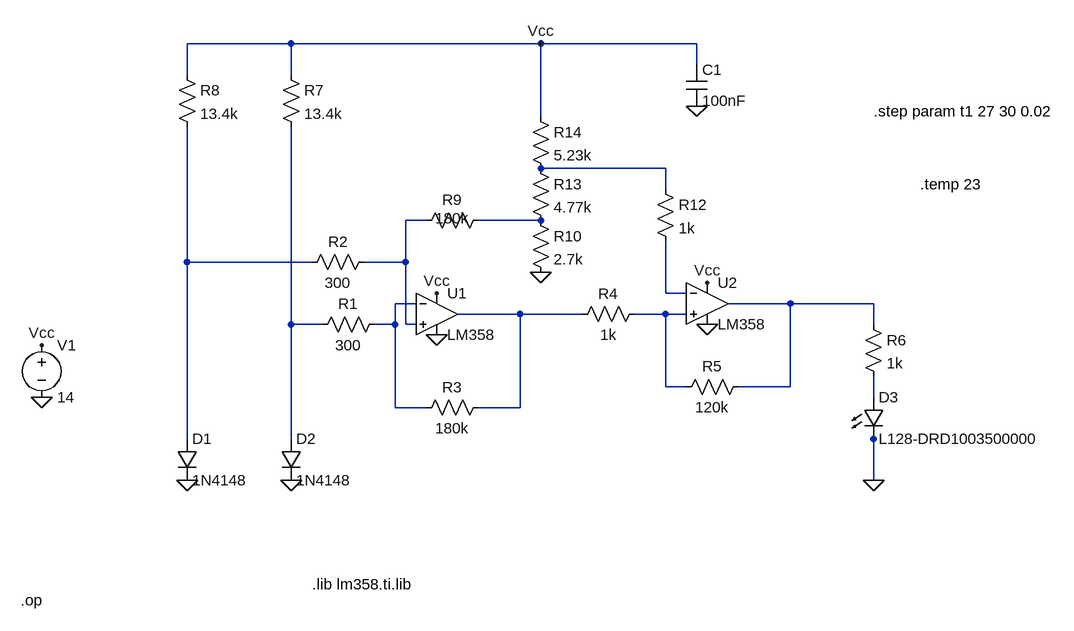
[diagram p0: schematic ECDLab1.asc]
ECDLab1.asc, the LTspice schematic file:
Version 4
SHEET 1 1204 808
WIRE -16 -176 -176 -176
WIRE 368 -176 -16 -176
WIRE 608 -176 368 -176
WIRE 608 -144 608 -176
WIRE -176 -128 -176 -176
WIRE -16 -128 -16 -176
WIRE 368 -64 368 -176
WIRE 560 16 368 16
WIRE 560 48 560 16
WIRE 192 96 160 96
WIRE 368 96 272 96
WIRE -176 160 -176 -48
WIRE 16 160 -176 160
WIRE 160 160 160 96
WIRE 160 160 96 160
WIRE 560 208 560 128
WIRE 592 208 560 208
WIRE 176 224 144 224
WIRE 752 224 656 224
WIRE 880 224 752 224
WIRE 336 240 240 240
WIRE 432 240 336 240
WIRE 560 240 512 240
WIRE 592 240 560 240
WIRE -16 256 -16 -48
WIRE 32 256 -16 256
WIRE 144 256 144 224
WIRE 144 256 112 256
WIRE 160 256 160 160
WIRE 176 256 160 256
WIRE 880 256 880 224
WIRE 560 352 560 240
WIRE 592 352 560 352
WIRE 752 352 752 224
WIRE 752 352 672 352
WIRE 880 368 880 336
WIRE 144 384 144 256
WIRE 192 384 144 384
WIRE 336 384 336 240
WIRE 336 384 272 384
WIRE -176 432 -176 160
WIRE -16 432 -16 256
WIRE 880 432 880 416
WIRE 880 496 880 432
FLAG -16 496 0
FLAG -176 496 0
FLAG 880 496 0
FLAG 608 -80 0
FLAG 208 208 Vcc
FLAG 368 -176 Vcc
FLAG 624 192 Vcc
FLAG -400 368 0
FLAG -400 288 Vcc
FLAG 208 272 0
FLAG 624 256 0
FLAG 368 176 0
SYMBOL res 128 240 R90
WINDOW 0 0 56 VBottom 2
WINDOW 3 32 56 VTop 2
SYMATTR InstName R1
SYMATTR Value 300
SYMBOL OpAmps\\opamp2 208 176 R0
SYMATTR InstName U1
SYMATTR Value LM358
SYMBOL res 112 144 R90
WINDOW 0 0 56 VBottom 2
WINDOW 3 32 56 VTop 2
SYMATTR InstName R2
SYMATTR Value 300
SYMBOL diode -192 432 R0
SYMATTR InstName D1
SYMATTR Value 1N4148
SYMBOL diode -32 432 R0
SYMATTR InstName D2
SYMATTR Value 1N4148
SYMATTR Value2 temp = { t1}
SYMBOL res 288 368 R90
WINDOW 0 0 56 VBottom 2
WINDOW 3 32 56 VTop 2
SYMATTR InstName R3
SYMATTR Value 180k
SYMBOL res 528 224 R90
WINDOW 0 0 56 VBottom 2
WINDOW 3 32 56 VTop 2
SYMATTR InstName R4
SYMATTR Value 1k
SYMBOL OpAmps\\opamp2 624 160 R0
SYMATTR InstName U2
SYMATTR Value LM358
SYMBOL res 688 336 R90
WINDOW 0 0 56 VBottom 2
WINDOW 3 32 56 VTop 2
SYMATTR InstName R5
SYMATTR Value 120k
SYMBOL res -32 -144 R0
SYMATTR InstName R7
SYMATTR Value 13.4k
SYMBOL res -192 -144 R0
SYMATTR InstName R8
SYMATTR Value 13.4k
SYMBOL res 288 80 R90
WINDOW 0 0 56 VBottom 2
WINDOW 3 28 56 VBottom 2
SYMATTR InstName R9
SYMATTR Value 180k
SYMBOL cap 592 -144 R0
SYMATTR InstName C1
SYMATTR Value 100nF
SYMBOL LED 864 368 R0
SYMATTR InstName D3
SYMATTR Value L128-DRD1003500000
SYMBOL res 864 240 R0
SYMATTR InstName R6
SYMATTR Value 1k
SYMBOL voltage -400 272 R0
WINDOW 123 0 0 Left 0
WINDOW 39 0 0 Left 0
SYMATTR InstName V1
SYMATTR Value 14
SYMBOL res 352 80 R0
SYMATTR InstName R10
SYMATTR Value 2.7k
SYMBOL res 544 32 R0
SYMATTR InstName R12
SYMATTR Value 1k
SYMBOL res 352 0 R0
SYMATTR InstName R13
SYMATTR Value 4.77k
SYMBOL res 352 -80 R0
SYMATTR InstName R14
SYMATTR Value 5.23k
TEXT 16 656 Left 2 !.lib lm358.ti.lib
TEXT 952 40 Left 2 !.temp 23
TEXT 880 -72 Left 2 !.step param t1 27 30 0.02
TEXT -432 680 Left 2 !.op

The netlist it stands for:
* ECDLab1.asc
R1 N006 N010 300
XU1 N002 N006 Vcc 0 N008 LM358  ; pins In+ In- V+ V- OUT
R2 N002 N004 300
D1 N004 0 1N4148
D2 N010 0 1N4148 temp = { t1}
R3 N008 N006 180k
R4 N009 N008 1k
XU2 N009 N005 Vcc 0 N007 LM358  ; pins In+ In- V+ V- OUT
R5 N007 N009 120k
R7 Vcc N010 13.4k
R8 Vcc N004 13.4k
R9 N003 N002 180k
C1 Vcc 0 100nF
D3 N011 0 L128-DRD1003500000
R6 N007 N011 1k
V1 Vcc 0 14
R10 N003 0 2.7k
R12 N001 N005 1k
R13 N001 N003 4.77k
R14 Vcc N001 5.23k
.model D D
.lib standard.dio
.lib lm358.ti.lib
.temp 23
.step param t1 27 30 0.02
.op
.backanno
.end